# Altium schematic sheet MotorControl.SchDoc: MotorControl
size A4; DocumentNumber: MB1144; Revision: C-02; SheetNumber: 23; SheetTotal: 25; Project: STM32L476G-EVAL; ModifiedDate: 9/23/2015
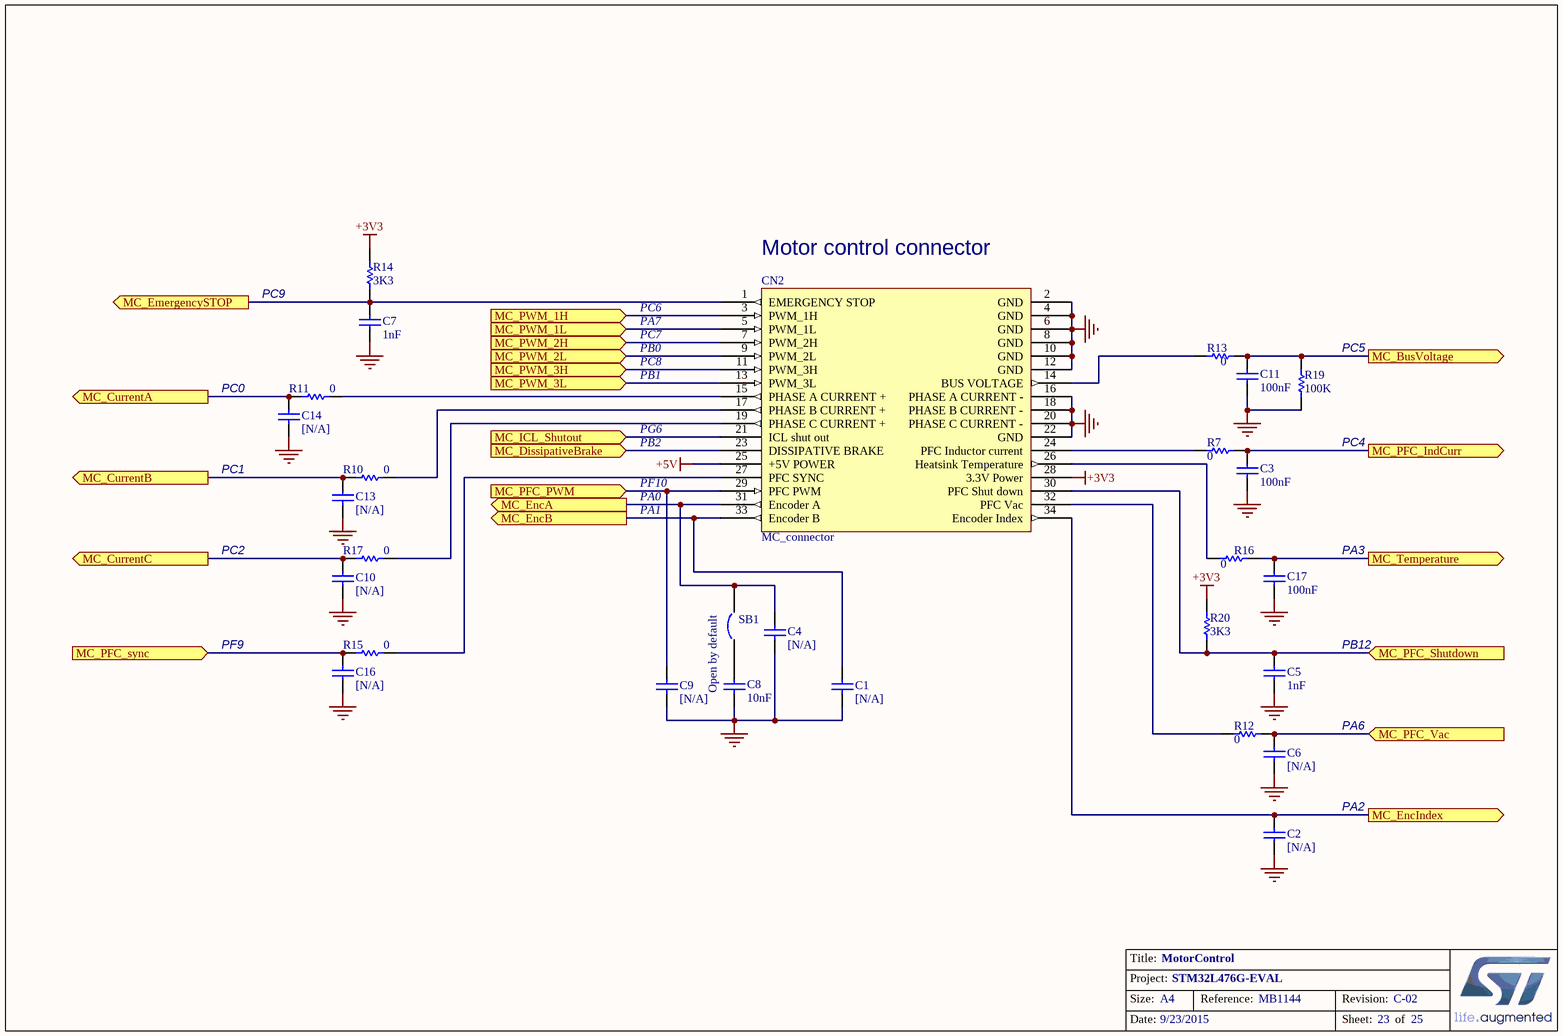
[diagram p0: MotorControl.SchDoc]

## Parts
C1  [N/A]  [0603C]
C2  [N/A]  [0603C]
C3  100nF  [0402C]
C4  [N/A]  [0603C]
C5  1nF  [0402C]
C6  [N/A]  [0603C]
C7  1nF  [0402C]
C8  10nF  [0402C]
C9  [N/A]  [0603C]
C10  [N/A]  [0603C]
C11  100nF  [0402C]
C13  [N/A]  [0603C]
C14  [N/A]  [0603C]
C16  [N/A]  [0603C]
C17  100nF  [0402C]
CN2  MC_connector  [IDC34S]
R7  0  [0603R]
R10  0  [0603R]
R11  0  [0603R]
R12  0  [0603R]
R13  0  [0603R]
R14  3K3  [0402R]
R15  0  [0603R]
R16  0  [0603R]
R17  0  [0603R]
R19  100K  [0402R]
R20  3K3  [0402R]
SB1  Open by default  [SB_0603]

## Ports
MC_BusVoltage (out), MC_CurrentA (out), MC_CurrentB (out), MC_CurrentC (out), MC_DissipativeBrake (in), MC_EmergencySTOP (out), MC_EncA (out), MC_EncB (out), MC_EncIndex (out), MC_ICL_Shutout (in), MC_PFC_IndCurr (out), MC_PFC_PWM (in), MC_PFC_Shutdown (in), MC_PFC_sync (in), MC_PFC_Vac (in), MC_PWM_1H (in), MC_PWM_1L (in), MC_PWM_2H (in), MC_PWM_2L (in), MC_PWM_3H (in), MC_PWM_3L (in), MC_Temperature (out)

## Nets
+3V3: CN2.28(3.3V_Power) R14.2 R20.2
+5V: CN2.25(+5V_POWER)
GND: C1.1 C2.1 C3.2 C4.1 C5.1 C6.1 C7.1 C8.2 C9.1 C10.1 C11.2 C13.1 C14.1 C16.1 C17.2 CN2.2(GND) CN2.4(GND) CN2.6(GND) CN2.8(GND) CN2.10(GND) CN2.12(GND) CN2.16(PHASE_A_CURRENT_-) CN2.18(PHASE_B_CURRENT_-) CN2.20(PHASE_C_CURRENT_-) CN2.22(GND) R19.2
MC_BusVoltage: C11.1 R13.2 R19.1 ; port MC_BusVoltage
MC_CurrentA: C14.2 R11.1 ; port MC_CurrentA
MC_CurrentB: C13.2 R10.1 ; port MC_CurrentB
MC_CurrentC: C10.2 R17.1 ; port MC_CurrentC
MC_DissipativeBrake: CN2.23(DISSIPATIVE_BRAKE) ; port MC_DissipativeBrake
MC_EmergencySTOP: C7.2 CN2.1(EMERGENCY_STOP) R14.1 ; port MC_EmergencySTOP
MC_EncA: C4.2 CN2.31(Encoder_A) SB1.2 ; port MC_EncA
MC_EncB: C1.2 CN2.33(Encoder_B) ; port MC_EncB
MC_EncIndex: C2.2 CN2.34(Encoder_Index) ; port MC_EncIndex
MC_ICL_Shutout: CN2.21(ICL_shut_out) ; port MC_ICL_Shutout
MC_PFC_IndCurr: C3.1 R7.2 ; port MC_PFC_IndCurr
MC_PFC_PWM: C9.2 CN2.29(PFC_PWM) ; port MC_PFC_PWM
MC_PFC_Shutdown: C5.2 CN2.30(PFC_Shut_down) R20.1 ; port MC_PFC_Shutdown
MC_PFC_sync: C16.2 R15.1 ; port MC_PFC_sync
MC_PFC_Vac: C6.2 R12.2 ; port MC_PFC_Vac
MC_PWM_1H: CN2.3(PWM_1H) ; port MC_PWM_1H
MC_PWM_1L: CN2.5(PWM_1L) ; port MC_PWM_1L
MC_PWM_2H: CN2.7(PWM_2H) ; port MC_PWM_2H
MC_PWM_2L: CN2.9(PWM_2L) ; port MC_PWM_2L
MC_PWM_3H: CN2.11(PWM_3H) ; port MC_PWM_3H
MC_PWM_3L: CN2.13(PWM_3L) ; port MC_PWM_3L
MC_Temperature: C17.1 R16.2 ; port MC_Temperature
NetC8_1: C8.1 SB1.1
NetCN2_14: CN2.14(BUS_VOLTAGE) R13.1
NetCN2_15: CN2.15(PHASE_A_CURRENT_+) R11.2
NetCN2_17: CN2.17(PHASE_B_CURRENT_+) R10.2
NetCN2_19: CN2.19(PHASE_C_CURRENT_+) R17.2
NetCN2_24: CN2.24(PFC_Inductor_current) R7.1
NetCN2_26: CN2.26(Heatsink_Temperature) R16.1
NetCN2_27: CN2.27(PFC_SYNC) R15.2
NetCN2_32: CN2.32(PFC_Vac) R12.1

## Notes on the sheet
- PC9
- PC6
- (near CN2) Motor control connector
- PA7
- PB0
- PB1
- PC7
- PC8
- (near R19) PC5
- PC0
- PG6
- PB2
- PC4
- PC1
- PA1
- PA0
- PF10
- PC2
- PA3
- PF9
- PB12
- PA6
- PA2
- Title:
- Project:
- Size:
- Date:
- A4
- Reference:
- Sheet:
- Revision:
- of

## Library data of the parts
C1 C2 C4 C6 C9 C10 C13 C14 C16 = cap: Capacitor; Value: 100pF; Ordered by: Subcon; ECCN_US/EU: NA; Fitted: NO; Published: 8-Jun-2000; Revision: July-2002: Re-released for DXP Platform.; Publisher: Altium Limited
C3 C11 C17 = Cap: Capacitor; Value: 10nF; Ordered by: Subcon; ECCN_US/EU: NA; Published: 8-Jun-2000; Revision: July-2002: Re-released for DXP Platform.; Publisher: Altium Limited
C5 C7 C8 = CAP: Capacitor; Value: 100pF; Ordered by: Subcon; ECCN_US/EU: NA; Published: 8-Jun-2000; Revision: July-2002: Re-released for DXP Platform.; Publisher: Altium Limited
CN2 = MC_connector_1: Ordered by: Subcon; Comments: Motor Control conn.; ECCN_US/EU: NA
R7 R10-R17 R20 = Res1: Resistor; Value: 1K; Ordered by: Subcon; ECCN_US/EU: NA; Published: 8-Jun-2000; Revision: July-2002: Re-released for DXP Platform.; Publisher: Altium Limited
R19 = res1: Resistor; Value: 1K; Ordered by: Subcon; ECCN_US/EU: NA; Published: 8-Jun-2000; Revision: July-2002: Re-released for DXP Platform.; Publisher: Altium Limited
SB1 = Circuit Breaker: Ordered by: Subcon; Comments: Solder bridge; Fitted: NO; ECCN_US/EU: NA; Published: 24-Mar-1999; Revision: July-2002: Re-released for DXP Platform.; Publisher: Altium Limited